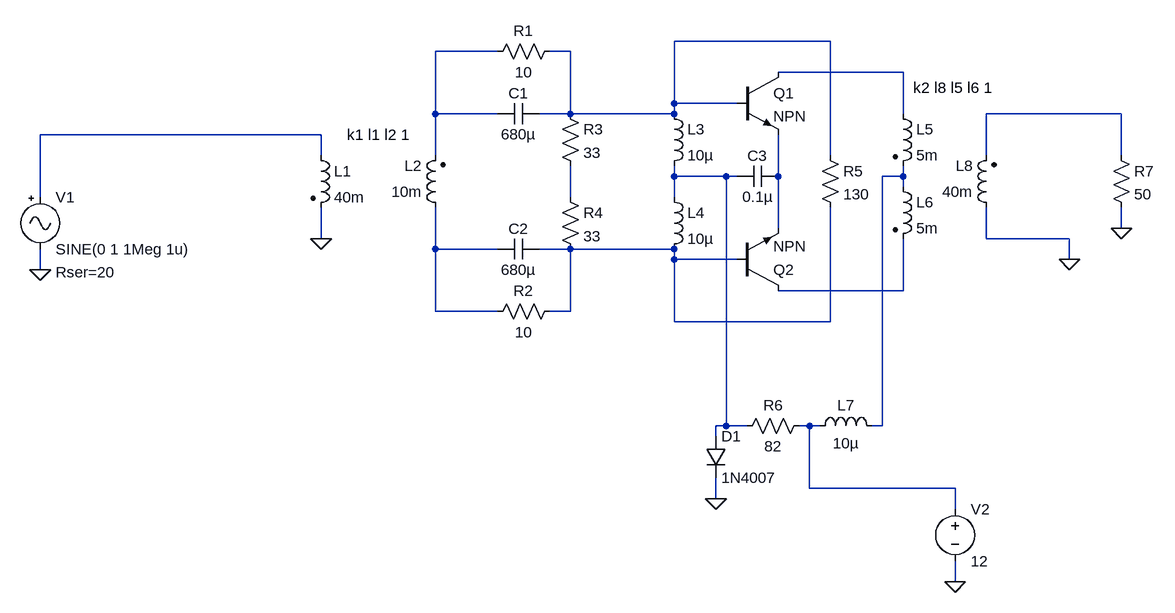
[diagram p0: schematic Draft2.asc]
Draft2.asc, the LTspice schematic file:
Version 4
SHEET 1 1640 756
WIRE 1136 -96 896 -96
WIRE 624 -80 528 -80
WIRE 736 -80 704 -80
WIRE 1248 -48 1056 -48
WIRE 896 0 896 -96
WIRE 992 0 896 0
WIRE 528 16 528 -80
WIRE 624 16 528 16
WIRE 736 16 736 -80
WIRE 736 16 688 16
WIRE 896 16 896 0
WIRE 896 16 736 16
WIRE 1248 16 1248 -48
WIRE 1584 16 1376 16
WIRE 352 48 -80 48
WIRE 352 80 352 48
WIRE 528 80 528 16
WIRE 1136 80 1136 -96
WIRE 1376 80 1376 16
WIRE 1584 80 1584 16
WIRE 896 112 896 96
WIRE 976 112 896 112
WIRE 992 112 976 112
WIRE 1056 112 1056 48
WIRE 1248 112 1248 96
WIRE 1248 112 1216 112
WIRE 1248 128 1248 112
WIRE -80 144 -80 48
WIRE 736 144 736 96
WIRE 896 144 896 112
WIRE 1056 192 1056 112
WIRE 1584 192 1584 160
WIRE 352 208 352 160
WIRE 1376 208 1376 160
WIRE 1504 208 1376 208
WIRE 528 224 528 160
WIRE 624 224 528 224
WIRE 736 224 688 224
WIRE 896 224 736 224
WIRE 896 240 896 224
WIRE 992 240 896 240
WIRE 1504 240 1504 208
WIRE -80 256 -80 224
WIRE 1248 288 1248 208
WIRE 1248 288 1056 288
WIRE 528 320 528 224
WIRE 624 320 528 320
WIRE 736 320 736 224
WIRE 736 320 704 320
WIRE 896 336 896 240
WIRE 1136 336 1136 160
WIRE 1136 336 896 336
WIRE 976 496 976 112
WIRE 976 496 960 496
WIRE 1008 496 976 496
WIRE 1104 496 1088 496
WIRE 1120 496 1104 496
WIRE 1216 496 1216 112
WIRE 1216 496 1200 496
WIRE 960 512 960 496
WIRE 1104 592 1104 496
WIRE 1328 592 1104 592
WIRE 960 608 960 576
WIRE 1328 624 1328 592
WIRE 1328 736 1328 704
FLAG -80 256 0
FLAG 352 208 0
FLAG 960 608 0
FLAG 1328 736 0
FLAG 1584 192 0
FLAG 1504 240 0
SYMBOL Misc\\signal -80 128 R0
WINDOW 123 0 0 Left 0
WINDOW 39 24 132 Left 2
SYMATTR InstName V1
SYMATTR Value SINE(0 1 1Meg 1u)
SYMATTR SpiceLine Rser=20
SYMBOL ind2 336 64 R0
SYMATTR InstName L1
SYMATTR Value 40m
SYMATTR Type ind
SYMBOL ind2 544 176 R180
WINDOW 0 36 80 Left 2
WINDOW 3 36 40 Left 2
SYMATTR InstName L2
SYMATTR Value 10m
SYMATTR Type ind
SYMBOL cap 688 0 R90
WINDOW 0 0 32 VBottom 2
WINDOW 3 32 32 VTop 2
SYMATTR InstName C1
SYMATTR Value 680µ
SYMBOL cap 688 208 R90
WINDOW 0 0 32 VBottom 2
WINDOW 3 32 32 VTop 2
SYMATTR InstName C2
SYMATTR Value 680µ
SYMBOL res 720 -96 R90
WINDOW 0 0 56 VBottom 2
WINDOW 3 32 56 VTop 2
SYMATTR InstName R1
SYMATTR Value 10
SYMBOL res 720 304 R90
WINDOW 0 0 56 VBottom 2
WINDOW 3 32 56 VTop 2
SYMATTR InstName R2
SYMATTR Value 10
SYMBOL res 720 0 R0
SYMATTR InstName R3
SYMATTR Value 33
SYMBOL res 720 128 R0
SYMATTR InstName R4
SYMATTR Value 33
SYMBOL ind 880 0 R0
SYMATTR InstName L3
SYMATTR Value 10µ
SYMBOL ind 880 128 R0
SYMATTR InstName L4
SYMATTR Value 10µ
SYMBOL cap 1056 96 R90
WINDOW 0 0 32 VBottom 2
WINDOW 3 32 32 VTop 2
SYMATTR InstName C3
SYMATTR Value 0.1µ
SYMBOL npn 992 -48 R0
SYMATTR InstName Q1
SYMBOL npn 992 288 M180
SYMATTR InstName Q2
SYMBOL ind2 1232 0 R0
SYMATTR InstName L5
SYMATTR Value 5m
SYMATTR Type ind
SYMBOL ind2 1232 112 R0
SYMATTR InstName L6
SYMATTR Value 5m
SYMATTR Type ind
SYMBOL res 1120 64 R0
SYMATTR InstName R5
SYMATTR Value 130
SYMBOL diode 944 512 R0
SYMATTR InstName D1
SYMATTR Value 1N4007
SYMBOL res 1104 480 R90
WINDOW 0 0 56 VBottom 2
WINDOW 3 32 56 VTop 2
SYMATTR InstName R6
SYMATTR Value 82
SYMBOL ind 1104 512 R270
WINDOW 0 32 56 VTop 2
WINDOW 3 5 56 VBottom 2
SYMATTR InstName L7
SYMATTR Value 10µ
SYMBOL voltage 1328 608 R0
WINDOW 123 0 0 Left 0
WINDOW 39 0 0 Left 0
SYMATTR InstName V2
SYMATTR Value 12
SYMBOL ind2 1392 176 R180
WINDOW 0 36 80 Left 2
WINDOW 3 36 40 Left 2
SYMATTR InstName L8
SYMATTR Value 40m
SYMATTR Type ind
SYMBOL res 1568 64 R0
SYMATTR InstName R7
SYMATTR Value 50
TEXT 392 48 Left 2 !k1 l1 l2 1
TEXT 1264 -24 Left 2 !k2 l8 l5 l6 1

The netlist it stands for:
* Draft2.asc
V1 N005 0 SINE(0 1 1Meg 1u) Rser=20
L1 N005 0 40m
L2 N010 N002 10m
C1 N001 N002 680µ
C2 N011 N010 680µ
R1 N001 N002 10
R2 N011 N010 10
R3 N001 N009 33
R4 N009 N011 33
L3 N001 N006 10µ
L4 N006 N011 10µ
C3 N007 N006 0.1µ
Q1 N003 N001 N007 0 NPN
Q2 N012 N011 N007 0 NPN
L5 N003 N008 5m
L6 N008 N012 5m
R5 N001 N011 130
D1 N006 0 1N4007
R6 N013 N006 82
L7 N013 N008 10µ
V2 N013 0 12
L8 0 N004 40m
R7 N004 0 50
.model D D
.lib standard.dio
.model NPN NPN
.model PNP PNP
.lib standard.bjt
k1 l1 l2 1
k2 l8 l5 l6 1
.backanno
.end